# Altium schematic sheet TDII_CPU_R00.SchDoc: TDII_CPU_LPC
size B; Revision: R0.0
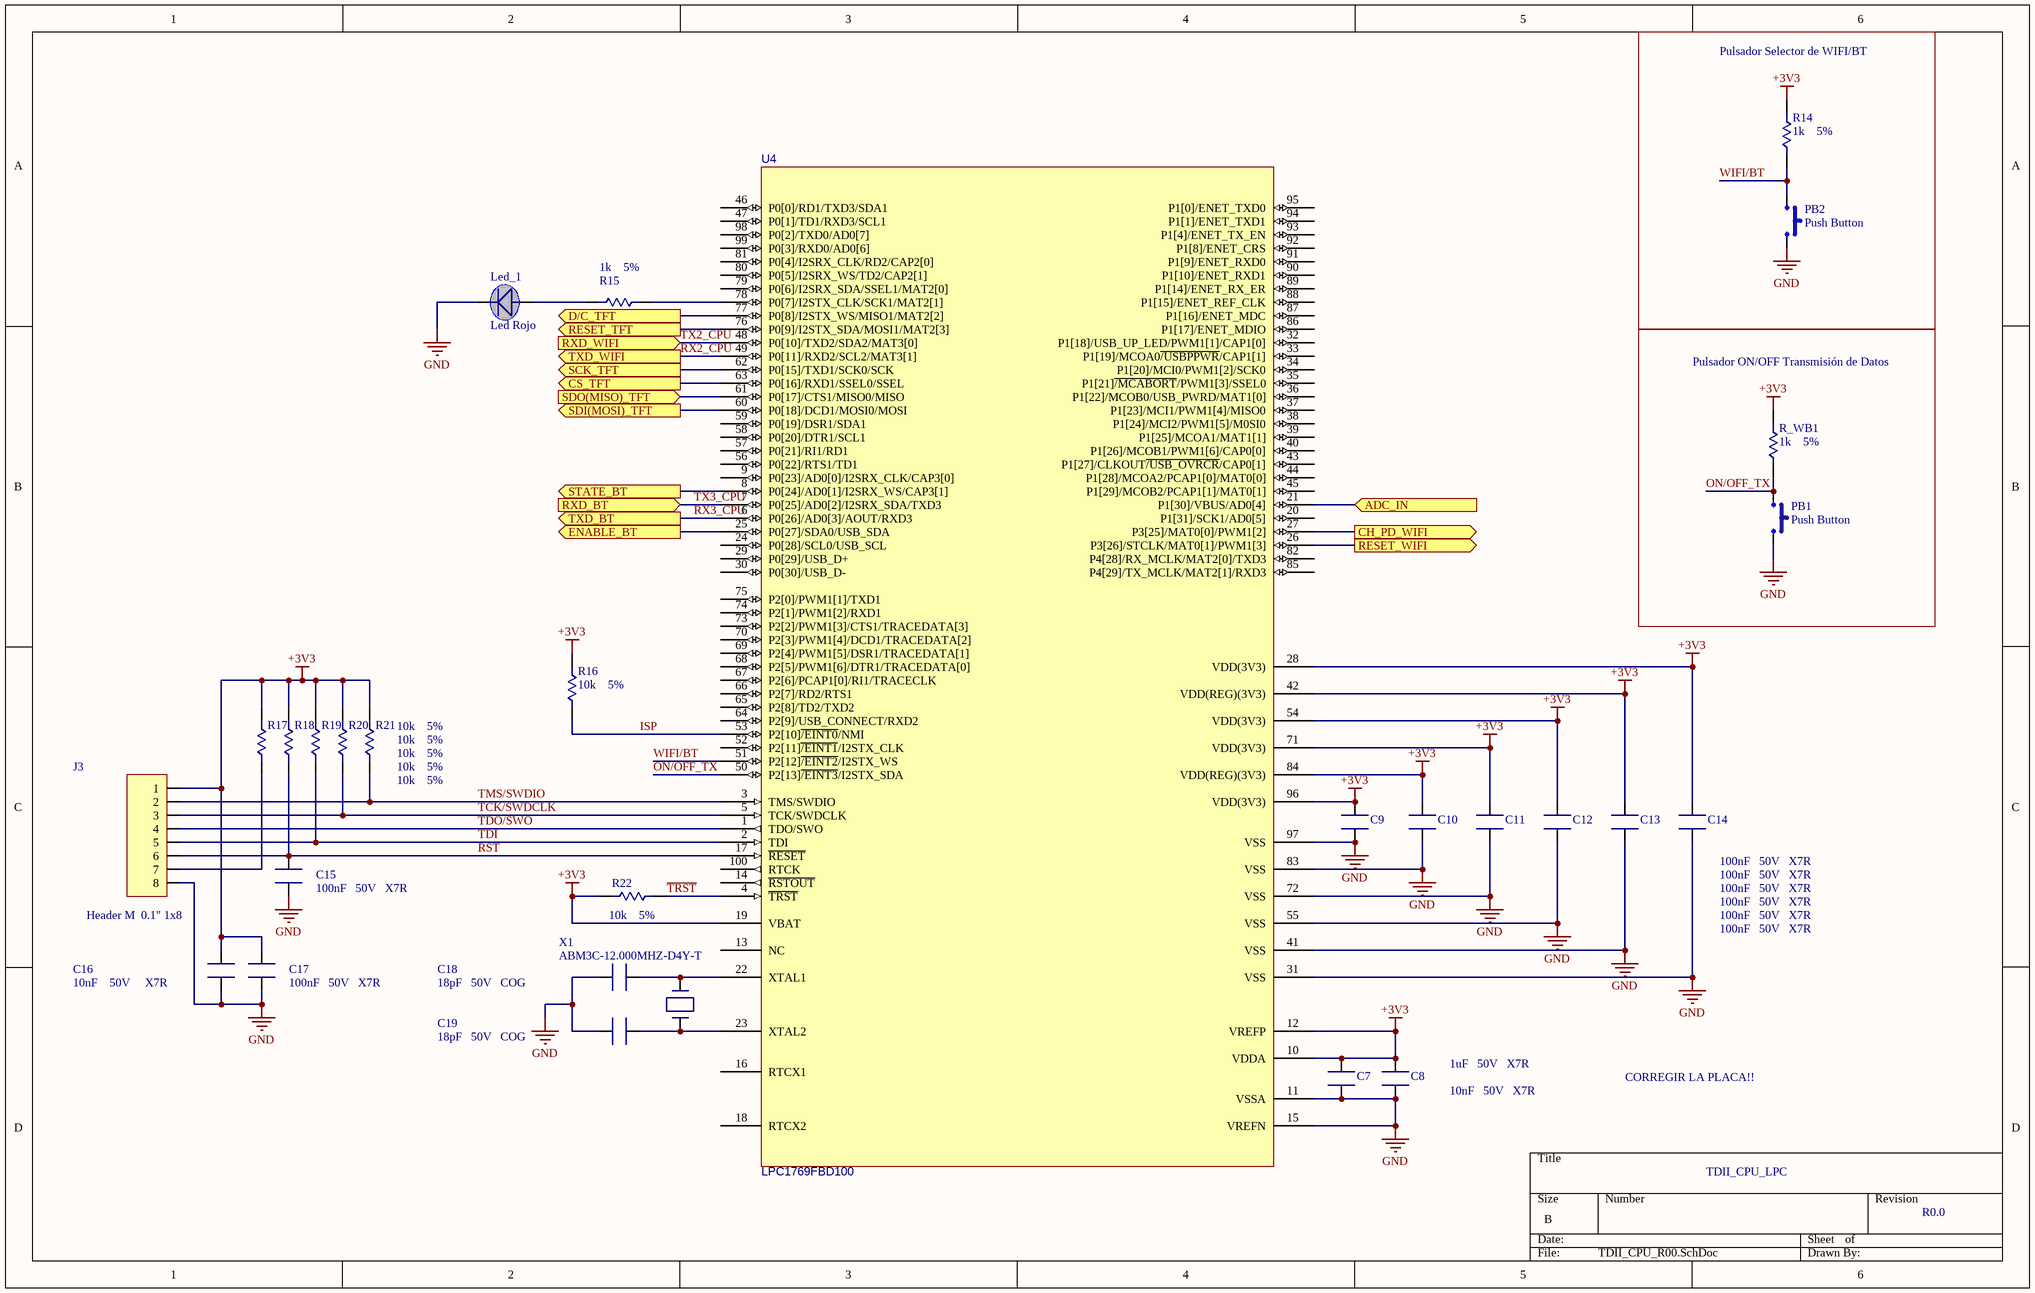
[diagram p0: TDII_CPU_R00.SchDoc]

## Parts
C7  10nF   50V   X7R  [C_0805]
C8  1uF   50V   X7R  [C_0805]
C9  100nF   50V   X7R  [C_0805]
C10  100nF   50V   X7R  [C_0805]
C11  100nF   50V   X7R  [C_0805]
C12  100nF   50V   X7R  [C_0805]
C13  100nF   50V   X7R  [C_0805]
C14  100nF   50V   X7R  [C_0805]
C15  100nF   50V   X7R  [C_0805]
C16  10nF    50V     X7R  [C_0805]
C17  100nF   50V   X7R  [C_0805]
C18  18pF   50V   COG  [C_0805]
C19  18pF   50V   COG  [C_0805]
J3  Header M  0.1" 1x8  [Header_THT]
Led_1  Led Rojo  [LED_0805]
PB1  Push Button  [HEADER_1x2]
PB2  Push Button  [HEADER_1x2]
R14  1k    5%  [R_0805]
R15  1k    5%  [R_0805]
R16  10k    5%  [R_0805]
R17  10k    5%  [R_0805]
R18  10k    5%  [R_0805]
R19  10k    5%  [R_0805]
R20  10k    5%  [R_0805]
R21  10k    5%  [R_0805]
R22  10k    5%  [R_0805]
R_WB1  1k    5%  [R_0805]
U4  LPC1769FBD100  [LQFP100]
X1  ABM3C-12.000MHZ-D4Y-T  [ABM3C]

## Blocks framed on the sheet
Pulsador Selector de WIFI/BT: PB2 R14
Pulsador ON/OFF Transmisión de Datos: PB1 R_WB1

## Ports
ADC_IN (in), CH_PD_WIFI (out), CS_TFT (out), D/C_TFT (out), ENABLE_BT (out), RESET_TFT (out), RESET_WIFI (out), RXD_BT (in), RXD_WIFI (in), SCK_TFT (out), SDI(MOSI)_TFT (out), SDO(MISO)_TFT (in), STATE_BT (out), TXD_BT (out), TXD_WIFI (out)

## Nets
+3V3: C7.1 C8.1 C9.1 C10.1 C11.1 C12.1 C13.1 C14.1 C16.1 C17.1 J3.1 R14.2 R16.2 R17.2 R18.2 R19.2 R20.2 R21.2 R22.1 R_WB1.2 U4.10(VDDA) U4.12(VREFP) U4.19(VBAT) U4.28(VDD(3V3)) U4.42(VDD(REG)(3V3)) U4.54(VDD(3V3)) U4.71(VDD(3V3)) U4.84(VDD(REG)(3V3)) U4.96(VDD(3V3))
GND: C7.2 C8.2 C9.2 C10.2 C11.2 C12.2 C13.2 C14.2 C15.2 C16.2 C17.2 C18.1 C19.1 J3.8 Led_1.2 PB1.2 PB2.2 U4.11(VSSA) U4.15(VREFN) U4.31(VSS) U4.41(VSS) U4.55(VSS) U4.72(VSS) U4.83(VSS) U4.97(VSS)
~{TRST}: R22.2 U4.4(~{TRST})
ADC_IN: U4.21(P1[30]/VBUS/AD0[4]) ; port ADC_IN
CH_PD_WIFI: U4.27(P3[25]/MAT0[0]/PWM1[2]) ; port CH_PD_WIFI
CS_TFT: U4.63(P0[16]/RXD1/SSEL0/SSEL) ; port CS_TFT
D/C_TFT: U4.77(P0[8]/I2STX_WS/MISO1/MAT2[2]) ; port D/C_TFT
ENABLE_BT: U4.25(P0[27]/SDA0/USB_SDA) ; port ENABLE_BT
ISP: R16.1 U4.53(P2[10]~{/EINT0}/NMI)
ON/OFF_TX: PB1.1 R_WB1.1 U4.50(P2[13]~{/EINT3}/I2STX_SDA)
RESET_TFT: U4.76(P0[9]/I2STX_SDA/MOSI1/MAT2[3]) ; port RESET_TFT
RESET_WIFI: U4.26(P3[26]/STCLK/MAT0[1]/PWM1[3]) ; port RESET_WIFI
RST: C15.1 J3.6 R18.1 U4.17(~{RESET})
RX2_CPU: U4.49(P0[11]/RXD2/SCL2/MAT3[1]) ; port TXD_WIFI
RX3_CPU: U4.6(P0[26]/AD0[3]/AOUT/RXD3) ; port TXD_BT
SCK_TFT: U4.62(P0[15]/TXD1/SCK0/SCK) ; port SCK_TFT
SDI(MOSI)_TFT: U4.60(P0[18]/DCD1/MOSI0/MOSI) ; port SDI(MOSI)_TFT
SDO(MISO)_TFT: U4.61(P0[17]/CTS1/MISO0/MISO) ; port SDO(MISO)_TFT
STATE_BT: U4.8(P0[24]/AD0[1]/I2SRX_WS/CAP3[1]) ; port STATE_BT
TCK/SWDCLK: J3.3 R20.1 U4.5(TCK/SWDCLK)
TDI: J3.5 R19.1 U4.2(TDI)
TDO/SWO: J3.4 U4.1(TDO/SWO)
TMS/SWDIO: J3.2 R21.1 U4.3(TMS/SWDIO)
TX2_CPU: U4.48(P0[10]/TXD2/SDA2/MAT3[0]) ; port RXD_WIFI
TX3_CPU: U4.7(P0[25]/AD0[2]/I2SRX_SDA/TXD3) ; port RXD_BT
WIFI/BT: PB2.1 R14.1 U4.51(P2[12]~{/EINT2}/I2STX_WS)
NetC18_2: C18.2 U4.22(XTAL1) X1.1
NetC19_2: C19.2 U4.23(XTAL2) X1.3
NetJ3_7: J3.7 R17.1
NetLed_1_1: Led_1.1 R15.1
NetR15_2: R15.2 U4.78(P0[7]/I2STX_CLK/SCK1/MAT2[1])

Not connected (* = marked no-connect by the designer): U4 9(P0[23]/AD0[0]/I2SRX_CLK/CAP3[0]) 13(NC) 14(~{RSTOUT}) 16(RTCX1) 18(RTCX2) 20(P1[31]/SCK1/AD0[5]) 24(P0[28]/SCL0/USB_SCL) 29(P0[29]/USB_D+) 30(P0[30]/USB_D-) 32(P1[18]/USB_UP_LED/PWM1[1]/CAP1[0]) 33(P1[19]/MCOA0~{/USBPPWR}/CAP1[1]) 34(P1[20]/MCI0/PWM1[2]/SCK0) 35(P1[21]~{/MCABORT}/PWM1[3]/SSEL0) 36(P1[22]/MCOB0/USB_PWRD/MAT1[0]) 37(P1[23]/MCI1/PWM1[4]/MISO0) 38(P1[24]/MCI2/PWM1[5]/M0SI0) 39(P1[25]/MCOA1/MAT1[1]) 40(P1[26]/MCOB1/PWM1[6]/CAP0[0]) 43(P1[27]/CLKOUT~{/USB_OVRCR}/CAP0[1]) 44(P1[28]/MCOA2/PCAP1[0]/MAT0[0]) 45(P1[29]/MCOB2/PCAP1[1]/MAT0[1]) 46(P0[0]/RD1/TXD3/SDA1) 47(P0[1]/TD1/RXD3/SCL1) 52(P2[11]~{/EINT1}/I2STX_CLK) 56(P0[22]/RTS1/TD1) 57(P0[21]/RI1/RD1) 58(P0[20]/DTR1/SCL1) 59(P0[19]/DSR1/SDA1) 64(P2[9]/USB_CONNECT/RXD2) 65(P2[8]/TD2/TXD2) 66(P2[7]/RD2/RTS1) 67(P2[6]/PCAP1[0]/RI1/TRACECLK) 68(P2[5]/PWM1[6]/DTR1/TRACEDATA[0]) 69(P2[4]/PWM1[5]/DSR1/TRACEDATA[1]) 70(P2[3]/PWM1[4]/DCD1/TRACEDATA[2]) 73(P2[2]/PWM1[3]/CTS1/TRACEDATA[3]) 74(P2[1]/PWM1[2]/RXD1) 75(P2[0]/PWM1[1]/TXD1) 79(P0[6]/I2SRX_SDA/SSEL1/MAT2[0]) 80(P0[5]/I2SRX_WS/TD2/CAP2[1]) 81(P0[4]/I2SRX_CLK/RD2/CAP2[0]) 82(P4[28]/RX_MCLK/MAT2[0]/TXD3) 85(P4[29]/TX_MCLK/MAT2[1]/RXD3) 86(P1[17]/ENET_MDIO) 87(P1[16]/ENET_MDC) 88(P1[15]/ENET_REF_CLK) 89(P1[14]/ENET_RX_ER) 90(P1[10]/ENET_RXD1) 91(P1[9]/ENET_RXD0) 92(P1[8]/ENET_CRS) 93(P1[4]/ENET_TX_EN) 94(P1[1]/ENET_TXD1) 95(P1[0]/ENET_TXD0) 98(P0[2]/TXD0/AD0[7]) 99(P0[3]/RXD0/AD0[6]) 100(RTCK)

## Notes on the sheet
- CORREGIR LA PLACA!!

## Library data of the parts
C7-C19 = CAP
J3 = Header
Led_1 = LED
R14-R22 R_WB1 = RES
U4 = LPC1768FBD100: CPU Cortex M3; Digi-Key Part Number: 568-4966-ND
X1 = ABM3_CRISTAL: Digi-Key Part Number: 535-11281-1-ND